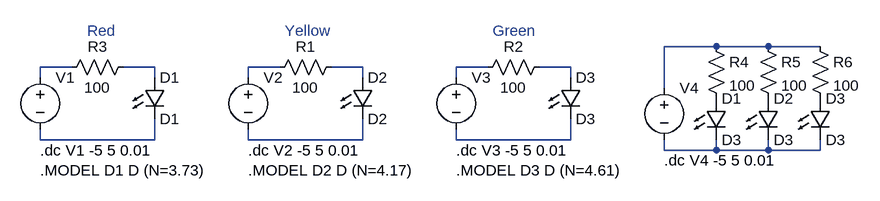
[diagram p0: schematic LEDs.asc]
LEDs.asc, the LTspice schematic file:
Version 4
SHEET 1 1180 680
WIRE 864 144 784 144
WIRE 944 144 864 144
WIRE 1024 144 944 144
WIRE -128 176 -176 176
WIRE 0 176 -48 176
WIRE 192 176 144 176
WIRE 320 176 272 176
WIRE 512 176 464 176
WIRE 640 176 592 176
WIRE -176 192 -176 176
WIRE 0 192 0 176
WIRE 144 192 144 176
WIRE 320 192 320 176
WIRE 464 192 464 176
WIRE 640 192 640 176
WIRE 784 208 784 144
WIRE -176 288 -176 272
WIRE 0 288 0 256
WIRE 0 288 -176 288
WIRE 144 288 144 272
WIRE 320 288 320 256
WIRE 320 288 144 288
WIRE 464 288 464 272
WIRE 640 288 640 256
WIRE 640 288 464 288
WIRE 784 304 784 288
WIRE 864 304 864 288
WIRE 864 304 784 304
WIRE 944 304 944 288
WIRE 944 304 864 304
WIRE 1024 304 1024 288
WIRE 1024 304 944 304
SYMBOL voltage 144 176 R0
SYMATTR InstName V2
SYMATTR Value ""
SYMBOL Res 288 160 R90
WINDOW 0 0 56 VBottom 2
WINDOW 3 32 56 VTop 2
SYMATTR InstName R1
SYMATTR Value 100
SYMBOL LED 304 192 R0
SYMATTR InstName D2
SYMATTR Value D2
SYMATTR Description Schottky diode
SYMATTR Type schottky
SYMBOL voltage 464 176 R0
SYMATTR InstName V3
SYMATTR Value ""
SYMBOL Res 608 160 R90
WINDOW 0 0 56 VBottom 2
WINDOW 3 32 56 VTop 2
SYMATTR InstName R2
SYMATTR Value 100
SYMBOL LED 624 192 R0
SYMATTR InstName D3
SYMATTR Value D3
SYMATTR Description Schottky diode
SYMATTR Type schottky
SYMBOL voltage -176 176 R0
SYMATTR InstName V1
SYMATTR Value ""
SYMBOL Res -32 160 R90
WINDOW 0 0 56 VBottom 2
WINDOW 3 32 56 VTop 2
SYMATTR InstName R3
SYMATTR Value 100
SYMBOL LED -16 192 R0
SYMATTR InstName D1
SYMATTR Value D1
SYMATTR Description Schottky diode
SYMATTR Type schottky
SYMBOL voltage 784 192 R0
SYMATTR InstName V4
SYMATTR Value ""
SYMBOL LED 848 224 R0
SYMATTR InstName D1
SYMATTR Value D3
SYMATTR Description Schottky diode
SYMATTR Type schottky
SYMBOL LED 928 224 R0
SYMATTR InstName D2
SYMATTR Value D3
SYMATTR Description Schottky diode
SYMATTR Type schottky
SYMBOL LED 1008 224 R0
SYMATTR InstName D3
SYMATTR Value D3
SYMATTR Description Schottky diode
SYMATTR Type schottky
SYMBOL Res 848 128 R0
SYMATTR InstName R4
SYMATTR Value 100
SYMBOL Res 928 128 R0
SYMATTR InstName R5
SYMATTR Value 100
SYMBOL Res 1008 128 R0
SYMATTR InstName R6
SYMATTR Value 100
TEXT -176 304 Left 2 !.dc V1 -5 5 0.01\n.MODEL D1 D (N=3.73)
TEXT -104 120 Left 2 ;Red
TEXT 200 120 Left 2 ;Yellow
TEXT 520 120 Left 2 ;Green
TEXT 144 304 Left 2 !.dc V2 -5 5 0.01\n.MODEL D2 D (N=4.17)
TEXT 464 304 Left 2 !.dc V3 -5 5 0.01\n.MODEL D3 D (N=4.61)
TEXT 784 320 Left 2 !.dc V4 -5 5 0.01

The netlist it stands for:
* LEDs.asc
V2 N004 N009
R1 N005 N004 100
D2 N005 N009 D2
V3 N006 N010
R2 N007 N006 100
D3 N007 N010 D3
V1 N002 N008
R3 N003 N002 100
D1 N003 N008 D1
V4 N001 N011
D1 P001 N011 D3
D2 P002 N011 D3
D3 P003 N011 D3
R4 N001 P001 100
R5 N001 P002 100
R6 N001 P003 100
.model D D
.lib standard.dio
.dc V1 -5 5 0.01
.MODEL D1 D (N=3.73)
* Red
* Yellow
* Green
.dc V2 -5 5 0.01
.MODEL D2 D (N=4.17)
.dc V3 -5 5 0.01
.MODEL D3 D (N=4.61)
.dc V4 -5 5 0.01
.backanno
.end